# EAGLE design powermeter (EAGLE 9.6.2)

## Sheet 1 of 3
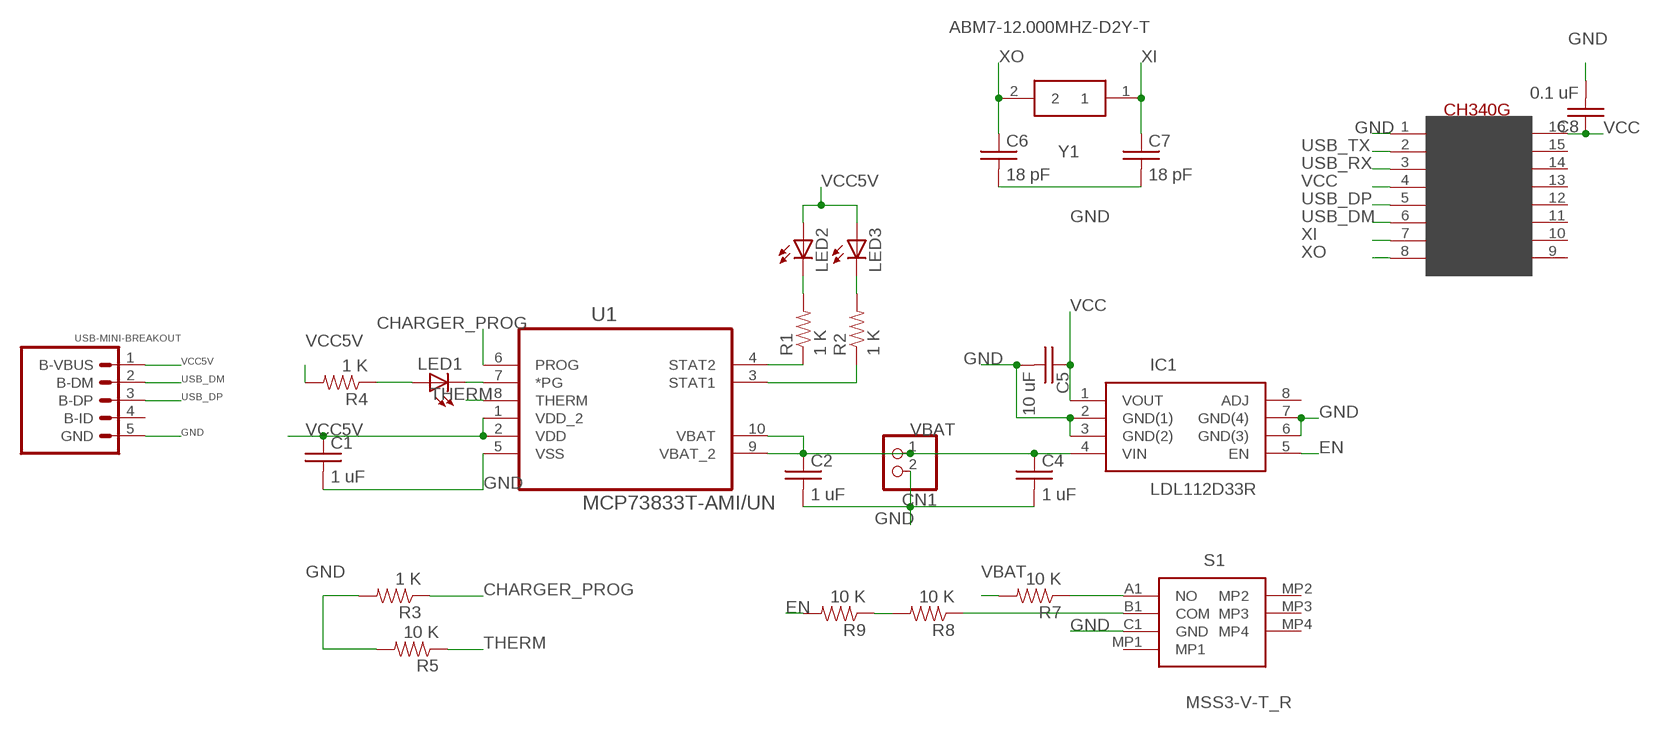
[diagram p0: schematic, sheet 1]

### Parts
C1  1 uF  C-USC0805K  [C0805K]
C2  1 uF  C-USC0805K  [C0805K]
C4  1 uF  C-USC0805K  [C0805K]
C5  10 uF  C-USC0805K  [C0805K]
C6  18 pF  C-USC0805K  [C0805K]
C7  18 pF  C-USC0805K  [C0805K]
C8  0.1 uF  C-USC0805K  [C0805K]
CN1  JST_2PIN-THM-RA  [JST-PH-2-THM-RA]
IC1  LDL112D33R  [SOIC127P600X175-8N]
LED1  LEDXZCFBB53W-8VF-2MA-LED  [LEDC1606X95N]
LED2  LEDXZCFBB53W-8VF-2MA-LED  [LEDC1606X95N]
LED3  LEDXZCFBB53W-8VF-2MA-LED  [LEDC1606X95N]
R1  1 K  RESISTORR0805-RES  [R0805]
R2  1 K  RESISTORR0805-RES  [R0805]
R3  1 K  RESISTORR0805-RES  [R0805]
R4  1 K  RESISTORR0805-RES  [R0805]
R5  10 K  RESISTORR0805-RES  [R0805]
R7  10 K  RESISTORR0805-RES  [R0805]
R8  10 K  RESISTORR0805-RES  [R0805]
R9  10 K  RESISTORR0805-RES  [R0805]
S1  MSS3-V-T_R  [MSS3VTR]
U1  MCP73833T-AMI/UN  [SOP50P490X110-10N]
U$4  CH340G  [SOIC16]
USB-MINI-BREAKOUT  USB-MINI-BREAKOUT  [1X05_LONGPADS]
Y1  ABM7-12.000MHZ-D2Y-T  [ABM7]

### Nets
CHARGER_PROG: R3.1 U1.6(PROG)
EN: IC1.5(EN) R9.2
GND: C1.2 C2.2 C4.2 C5.2 C6.2 C7.2 C8.2 CN1.2 IC1.2(GND(1)) IC1.3(GND(2)) IC1.6(GND(3)) IC1.7(GND(4)) R3.2 R5.2 S1.C1(GND) U1.5(VSS) U$4.1(GND) USB-MINI-BREAKOUT.5(GND) ; also sheet 2,3
N$1: R1.1 U1.4(STAT2)
N$2: LED1.2(C) U1.7(*PG)
N$3: LED1.1(A) R4.1
N$4: LED3.2(C) R2.2
N$5: R2.1 U1.3(STAT1)
N$6: LED2.2(C) R1.2
N$7: R8.2 R9.1
N$13: R8.1 S1.B1(COM)
N$15: R7.1 S1.A1(NO)
THERM: R5.1 U1.8(THERM)
USB_DM: U$4.6(D-) USB-MINI-BREAKOUT.2(B-DM)
USB_DP: U$4.5(D+) USB-MINI-BREAKOUT.3(B-DP)
USB_RX: U$4.3(RX) ; also sheet 3
USB_TX: U$4.2(TX) ; also sheet 3
VBAT: C2.1 C4.1 CN1.1 IC1.4(VIN) R7.2 U1.9(VBAT_2) U1.10(VBAT)
VCC: C5.1 C8.1 IC1.1(VOUT) U$4.4(V3) U$4.16(VCC) ; also sheet 2,3
VCC5V: C1.1 LED2.1(A) LED3.1(A) R4.2 U1.1(VDD_2) U1.2(VDD) USB-MINI-BREAKOUT.1(B-VBUS) ; also sheet 3
XI: C7.1 U$4.7(XI) Y1.1
XO: C6.1 U$4.8(XO) Y1.2
Unconnected: IC1.8(ADJ) S1.MP1 S1.MP2 S1.MP3 S1.MP4 U$4.9(CTS) U$4.10(DSR) U$4.11(RI) U$4.12(DCD) U$4.13(DTR) U$4.14(RTS) U$4.15(RS232) USB-MINI-BREAKOUT.4(B-ID)

## Sheet 2 of 3
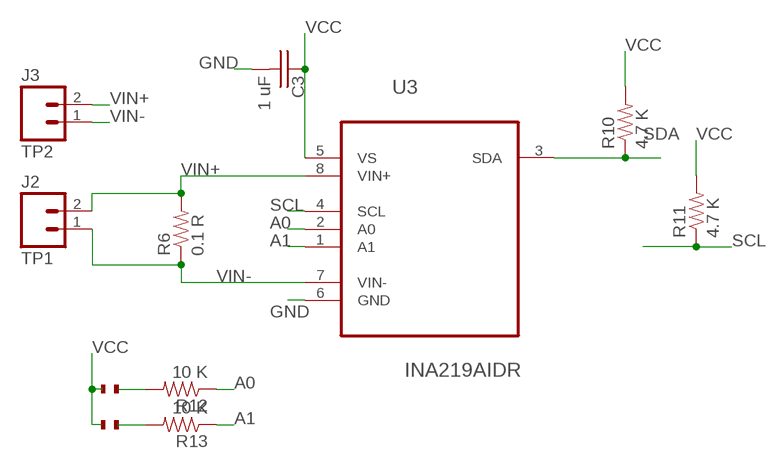
[diagram p1: schematic, sheet 2]

### Parts
C3  1 uF  C-USC0805K  [C0805K]
J2  TP1  M023.5MM  [SCREWTERMINAL-3.5MM-2]
J3  TP2  M02LOCK_LONGPADS  [1X02_LOCK_LONGPADS]
R6  0.1 R  RESISTOR2010  [R2010]
R10  4.7 K  RESISTORR0805-RES  [R0805]
R11  4.7 K  RESISTORR0805-RES  [R0805]
R12  10 K  RESISTORR0805-RES  [R0805]
R13  10 K  RESISTORR0805-RES  [R0805]
U3  INA219AIDR  [SOIC127P600X175-8N]
U$1  SURFACE_MOUNT_JUMP  [SURFACE_JUMPER]
U$2  SURFACE_MOUNT_JUMP  [SURFACE_JUMPER]

### Nets
A0: R12.1 U3.2(A0)
A1: R13.1 U3.1(A1)
GND: C3.2 U3.6(GND) ; also sheet 1,3
N$8: R12.2 U$1.2
N$10: R13.2 U$2.2
SCL: R11.1 U3.4(SCL) ; also sheet 3
SDA: R10.1 U3.3(SDA) ; also sheet 3
VCC: C3.1 R10.2 R11.2 U3.5(VS) U$1.1 U$2.1 ; also sheet 1,3
VIN+: J2.2 J3.2 R6.2 U3.8(VIN+)
VIN-: J2.1 J3.1 R6.1 U3.7(VIN-)

## Sheet 3 of 3
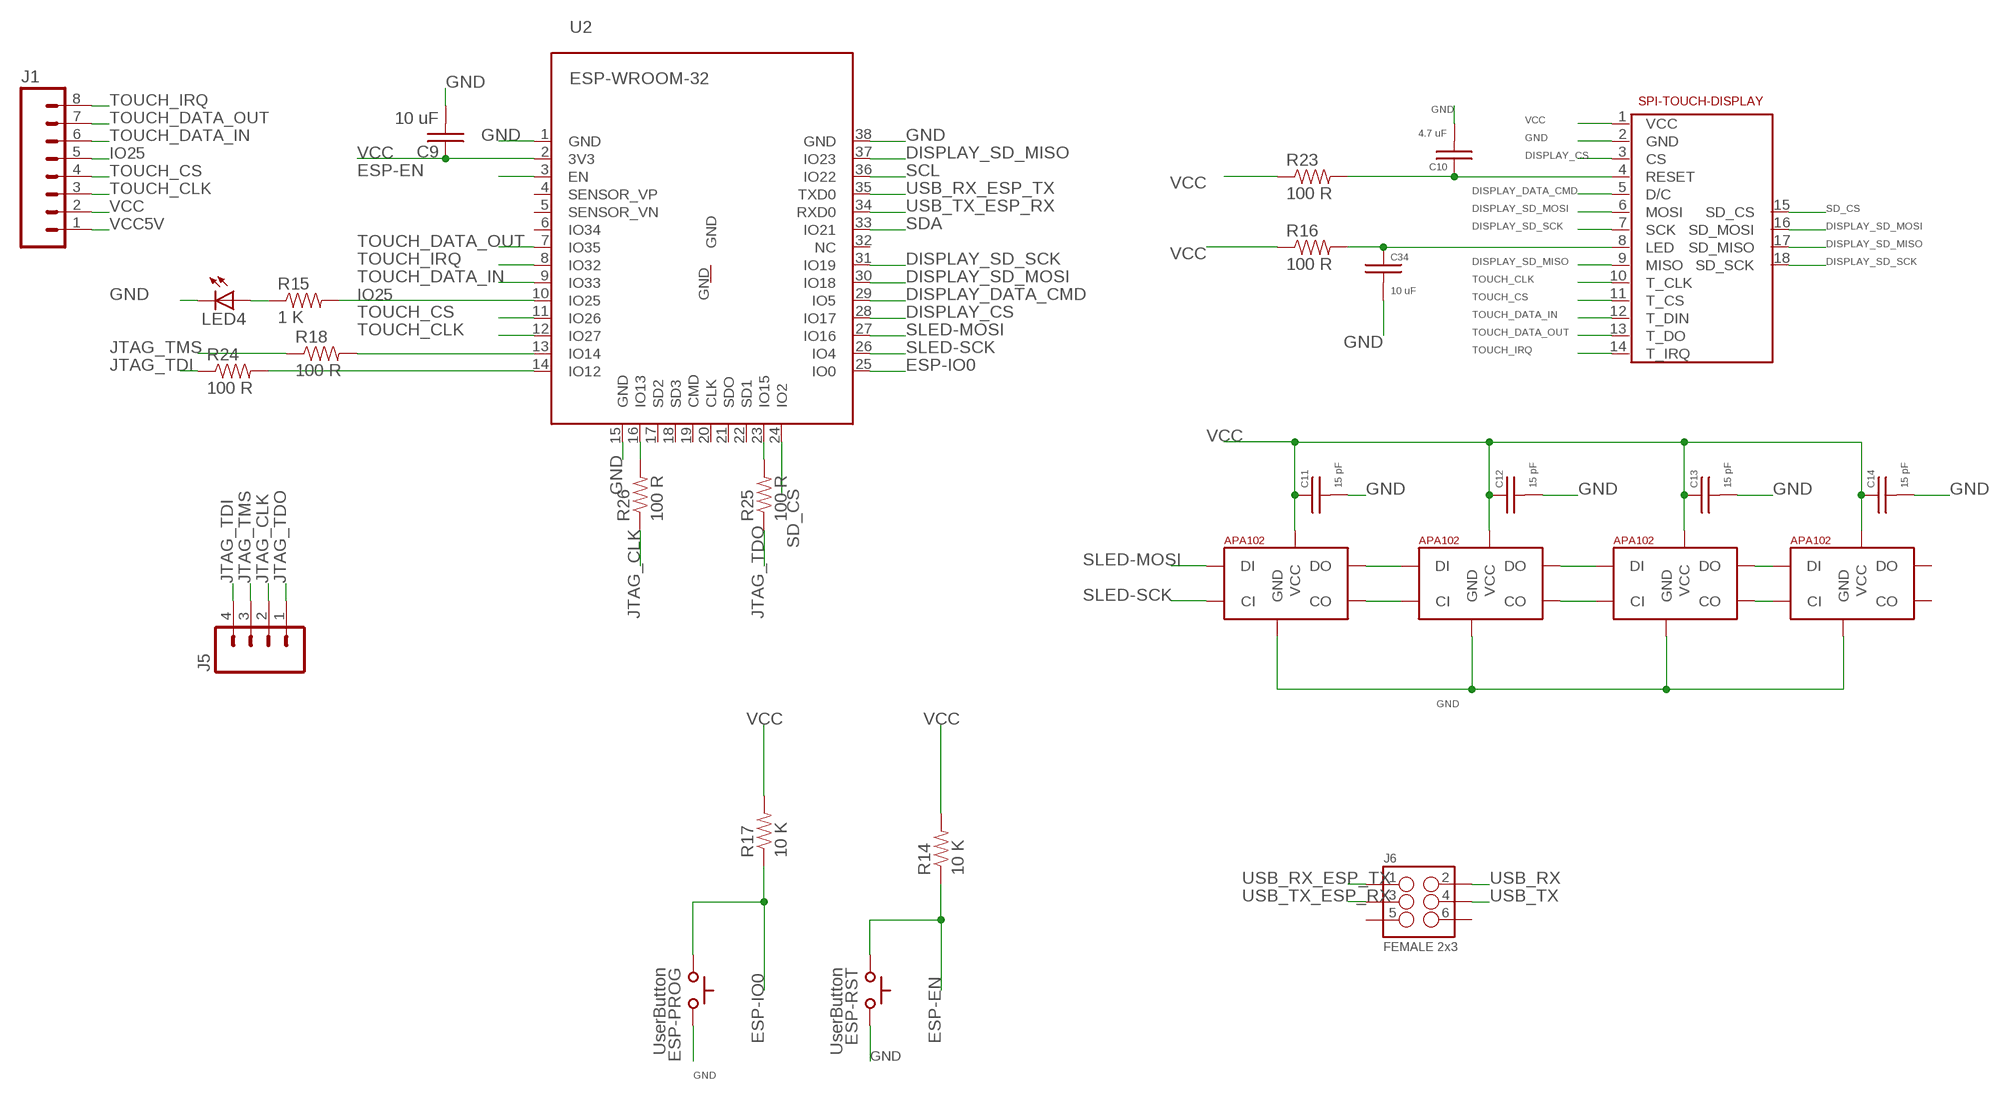
[diagram p2: schematic, sheet 3]

### Parts
C9  10 uF  C-USC0805K  [C0805K]
C10  4.7 uF  C-USC0805  [C0805]
C11  15 pF  C-USC0805  [C0805]
C12  15 pF  C-USC0805  [C0805]
C13  15 pF  C-USC0805  [C0805]
C14  15 pF  C-USC0805  [C0805]
C34  10 uF  C-USC0805  [C0805]
ESP-PROG  UserButton  SWITCH_TACTILETACTILE-2PIN-NARROW  [TACTILE-2PIN-NARROW]
ESP-RST  UserButton  SWITCH_TACTILETACTILE-2PIN-NARROW  [TACTILE-2PIN-NARROW]
J1  M08LONGPADS  [1X08_LONGPADS]
J5  M04LONGPADS  [1X04_LONGPADS]
J6  FEMALE 2x3  M03X2FEMALE  [2X3]
LED4  LED1206  [LED-1206]
R14  10 K  RESISTORR0805-RES  [R0805]
R15  1 K  RESISTORR0805-RES  [R0805]
R16  100 R  RESISTORR0805-RES  [R0805]
R17  10 K  RESISTORR0805-RES  [R0805]
R18  100 R  RESISTORR0805-RES  [R0805]
R23  100 R  RESISTORR0805-RES  [R0805]
R24  100 R  RESISTORR0805-RES  [R0805]
R25  100 R  RESISTORR0805-RES  [R0805]
R26  100 R  RESISTORR0805-RES  [R0805]
U2  ESP-WROOM-32  [ESP-WROOM-32]
U$3  2.4-SPI-TFT-TOUCH-SSD-MODULE  [2.4-SPI-TFT-TOUCH-SSD-MODULE]
U$5  APA1025050  [APA102_5050]
U$6  APA1025050  [APA102_5050]
U$7  APA1025050  [APA102_5050]
U$8  APA1025050  [APA102_5050]

### Nets
DISPLAY_BACKLIT: C34.1 R16.2 U$3.8(LED)
DISPLAY_CS: U2.28(IO17) U$3.3(CS)
DISPLAY_DATA_CMD: U2.29(IO5) U$3.5(D/C)
DISPLAY_RESET: C10.1 R23.2 U$3.4(RESET)
DISPLAY_SD_MISO: U2.37(IO23) U$3.9(MISO) U$3.17(SD_MISO)
DISPLAY_SD_MOSI: U2.30(IO18) U$3.6(MOSI) U$3.16(SD_MOSI)
DISPLAY_SD_SCK: U2.31(IO19) U$3.7(SCK) U$3.18(SD_SCK)
ESP-EN: ESP-RST.P$2(C) R14.1 U2.3(EN)
ESP-IO0: ESP-PROG.P$2(C) R17.1 U2.25(IO0)
GND: C9.2 C10.2 C11.2 C12.2 C13.2 C14.2 C34.2 ESP-PROG.P$1(A) ESP-RST.P$1(A) LED4.C U2.1(GND) U2.15(GND) U2.38(GND) U$3.2(GND) U$5.6(GND) U$6.6(GND) U$7.6(GND) U$8.6(GND) ; also sheet 1,2
IO25: J1.5 R15.2 U2.10(IO25)
JTAG_CLK: J5.2 R26.1
JTAG_TDI: J5.4 R24.1
JTAG_TDO: J5.1 R25.1
JTAG_TMS: J5.3 R18.1
N$9: R24.2 U2.14(IO12)
N$14: R26.2 U2.16(IO13)
N$17: LED4.A R15.1
N$18: U$5.2(CO) U$6.5(CI)
N$19: R18.2 U2.13(IO14)
N$20: R25.2 U2.23(IO15)
N$21: U$5.3(DO) U$6.4(DI)
N$22: U$6.3(DO) U$7.4(DI)
N$23: U$6.2(CO) U$7.5(CI)
N$24: U$7.2(CO) U$8.5(CI)
N$25: U$7.3(DO) U$8.4(DI)
SCL: U2.36(IO22) ; also sheet 2
SD_CS: U2.24(IO2) U$3.15(SD_CS)
SDA: U2.33(IO21) ; also sheet 2
SLED-MOSI: U2.27(IO16) U$5.4(DI)
SLED-SCK: U2.26(IO4) U$5.5(CI)
TOUCH_CLK: J1.3 U2.12(IO27) U$3.10(T_CLK)
TOUCH_CS: J1.4 U2.11(IO26) U$3.11(T_CS)
TOUCH_DATA_IN: J1.6 U2.9(IO33) U$3.12(T_DIN)
TOUCH_DATA_OUT: J1.7 U2.7(IO35) U$3.13(T_DO)
TOUCH_IRQ: J1.8 U2.8(IO32) U$3.14(T_IRQ)
USB_RX: J6.2 ; also sheet 1
USB_RX_ESP_TX: J6.1 U2.35(TXD0)
USB_TX: J6.4 ; also sheet 1
USB_TX_ESP_RX: J6.3 U2.34(RXD0)
VCC: C9.1 C11.1 C12.1 C13.1 C14.1 J1.2 R14.2 R16.1 R17.2 R23.1 U2.2(3V3) U$3.1(VCC) U$5.1(VCC) U$6.1(VCC) U$7.1(VCC) U$8.1(VCC) ; also sheet 1,2
VCC5V: J1.1 ; also sheet 1
Unconnected: J6.5 J6.6 U2.4(SENSOR_VP) U2.5(SENSOR_VN) U2.6(IO34) U2.17(SD2) U2.18(SD3) U2.19(CMD) U2.20(CLK) U2.21(SDO) U2.22(SD1) U2.32(NC) U2.GND U$8.2(CO) U$8.3(DO)

## Library data of the parts
C1-C14 C34 = passives:C-US: CAPACITOR, American symbol
CN1 = connector:JST_2PIN: JST 2-Pin Connectors of various flavors SMT-RA (S2B-PH-SM4) 4UConnector #17311 SMT (B2B-PH-SM4) THM-RA (S2B-PH) THM (B2B-PH)
ESP-PROG ESP-RST = dc-26:SWITCH_TACTILE
IC1 = voltage-regulator:LDL112D33R: LDO Voltage Regulators 1.2 A low quiescent current LDO with reverse current protection Source: Datasheet <https://www.arrow.com/en/products/ldl112d33r/stmicroelectronics>; ARROW_PART_NUMBER: LDL112D33R; ARROW_PRICE/STOCK: https://www.arrow.com/en/products/ldl112d33r/stmicroelectronics; DESCRIPTION: LDO Voltage Regulators 1.2 A low quiescent current LDO with reverse current protection; HEIGHT: 1.75mm; MANUFACTURER_NAME: STMicroelectronics; MANUFACTURER_PART_NUMBER: LDL112D33R
J1 = connector:M08: Header 8 Standard 8-pin 0.1" header. Use with straight break away headers (SKU : PRT-00116), right angle break away headers (PRT-00553), swiss pins (PRT-00743), machine pins (PRT-00117), and female headers (PRT-00115).
J2 = connector:M02: Standard 2-pin 0.1" header. Use with - straight break away headers ( PRT-00116) - right angle break away headers (PRT-00553) - swiss pins (PRT-00743) - machine pins (PRT-00117) - female headers (PRT-00115) Molex polarized connector foot print use with: PRT-08233 with associated crimp pins and housings. 2.54_SCREWTERM for use with PRT-10571. 3.5mm Screw Terminal footprints for PRT-08084 5mm Screw Terminal footprints for use with PRT-08432; PROD_ID: CONN-08399
J3 = connector:M02: Standard 2-pin 0.1" header. Use with - straight break away headers ( PRT-00116) - right angle break away headers (PRT-00553) - swiss pins (PRT-00743) - machine pins (PRT-00117) - female headers (PRT-00115) Molex polarized connector foot print use with: PRT-08233 with associated crimp pins and housings. 2.54_SCREWTERM for use with PRT-10571. 3.5mm Screw Terminal footprints for PRT-08084 5mm Screw Terminal footprints for use with PRT-08432
J5 = connector:M04: Header 4 Standard 4-pin 0.1" header. Use with straight break away headers (SKU : PRT-00116), right angle break away headers (PRT-00553), swiss pins (PRT-00743), machine pins (PRT-00117), and female headers (PRT-00115). Molex polarized connector foot print use with SKU : PRT-08231 with associated crimp pins and housings. 1MM SMD Version SKU: PRT-10208; PROD_ID: CONN-09696
J6 = connector:M03X2: 2x3 .1" header. Shrouded, with keying- CONN-10681 SMT- CONN-11415 Pogo pins- HW-11044; PROD_ID: CONN-11566
LED1-LED4 = leds:LED: LEDs Standard schematic elements and footprints for 5mm, 3mm, 1206, and 0603 sized LEDs. 5mm - Spark Fun Electronics SKU : COM-00529 (and others)
R1-R18 R23-R26 = passives:RESISTOR: Resistor Basic schematic elements and footprints for 0603, 1206, and PTH resistors.
S1 = switches:MSS3-V-T_R: Slide Switches Slide Type 1P2T (1.4mm height) Source: Datasheet <http://www.dip.com.tw/en/en-product-information/en-switch005/item/download/2643_3624e6da26abd0f9c3465d69564276ea>; DESCRIPTION: Slide Switches Slide Type 1P2T (1.4mm height); HEIGHT: 1.4mm; MANUFACTURER_NAME: Diptronics; MANUFACTURER_PART_NUMBER: MSS3-V-T/R; MOUSER_PART_NUMBER: 113-MSS3-V-T/R; MOUSER_PRICE-STOCK: https://www.mouser.com/Search/Refine.aspx?Keyword=113-MSS3-V-T%2FR
U1 = charging-ic:MCP73833T-AMI/UN: LI-ION/LI-POLY CONTROLLERS; AVAILABILITY: Unavailable; DESCRIPTION: Charger IC Lithium Ion/Polymer 10-MSOP; MF: Microchip; MP: MCP73833T-AMI/UN; PACKAGE: MSOP-10 Microchip; PRICE: None
U2 = ICs:ESP-WROOM-32
U3 = ICs:INA219AIDR: CURRENT/POWER MONITOR; AVAILABILITY: Unavailable; DESCRIPTION: Current Monitor Regulator High-Side 10mA 8-SOIC; MF: Texas Instruments; MP: INA219AIDR; PACKAGE: SOIC-8 Texas Instruments; PRICE: None
U$1 U$2 = connector:SURFACE_MOUNT_JUMP
U$3 = displays:2.4-SPI-TFT-TOUCH-SSD-MODULE: 2.4" SPI TFT Module Driver: ILI9341 DOTS: 240x320 Touch: YES
U$4 = protocol-converters:CH340G
U$5-U$8 = leds:APA102: APA102C 5050 RGB LED -- Adafruit DotStar Single LED Pixel Product Page: https://www.adafruit.com/products/2343 Datasheet: https://cdn-shop.adafruit.com/product-files/2343/APA102C.pdf
USB-MINI-BREAKOUT = connector:USB-MINI-BREAKOUT: Header 5 Standard 5-pin 0.1" header. Use with straight break away headers (SKU : PRT-00116), right angle break away headers (PRT-00553), swiss pins (PRT-00743), machine pins (PRT-00117), and female headers (PRT-00115). Molex polarized connector foot print use with SKU : PRT-08230 with associated crimp pins and housings.
Y1 = crystals-timing:ABM7-12.000MHZ-D2Y-T: ABRACON - ABM7-12.000MHZ-D2Y-T - CRYSTAL, 12MHZ, 18PF, SMD Source: Datasheet <http://www.abracon.com/Resonators/abm7.pdf>; DESCRIPTION: ABRACON - ABM7-12.000MHZ-D2Y-T - CRYSTAL, 12MHZ, 18PF, SMD; HEIGHT: mm; MANUFACTURER_NAME: ABRACON; MANUFACTURER_PART_NUMBER: ABM7-12.000MHZ-D2Y-T; MOUSER_PART_NUMBER: 815-ABM7-12-D2Y-T; MOUSER_PRICE-STOCK: https://www.mouser.com/Search/Refine.aspx?Keyword=815-ABM7-12-D2Y-T; RS_PART_NUMBER: 1710625P; RS_PRICE-STOCK: http://uk.rs-online.com/web/p/products/1710625P

## Board
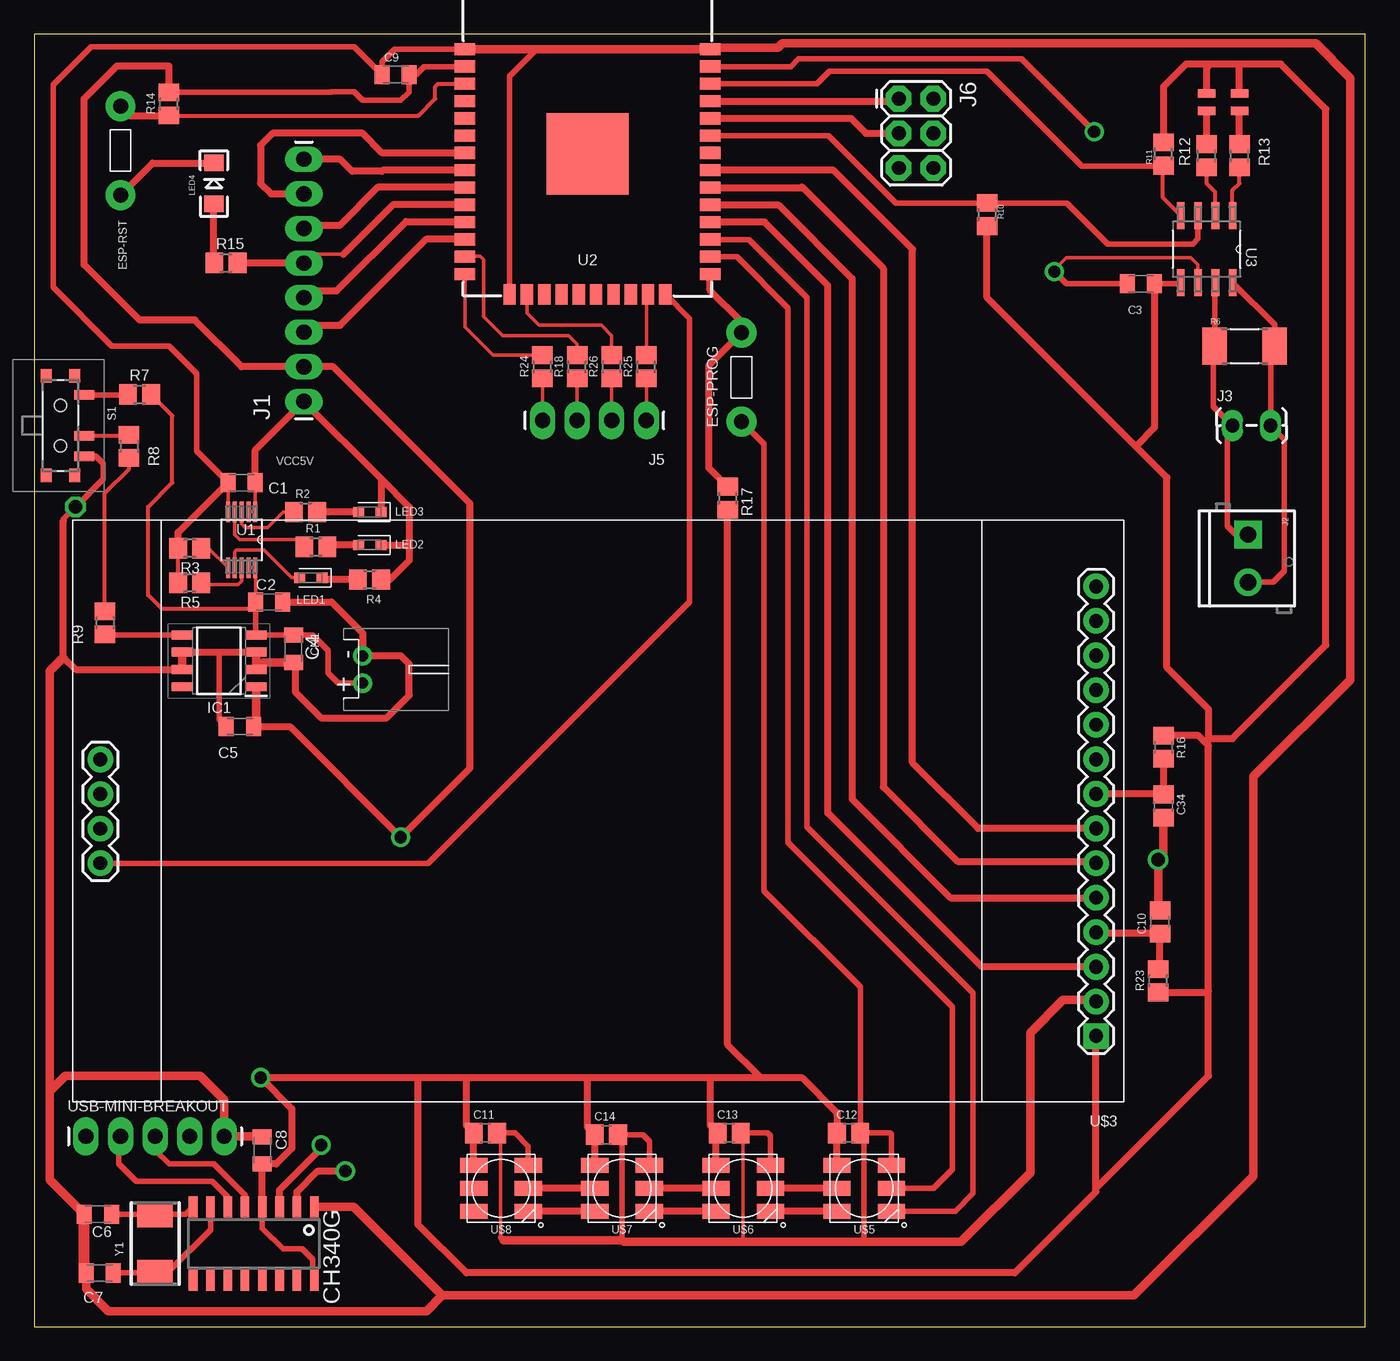
[diagram p3: board, top side]
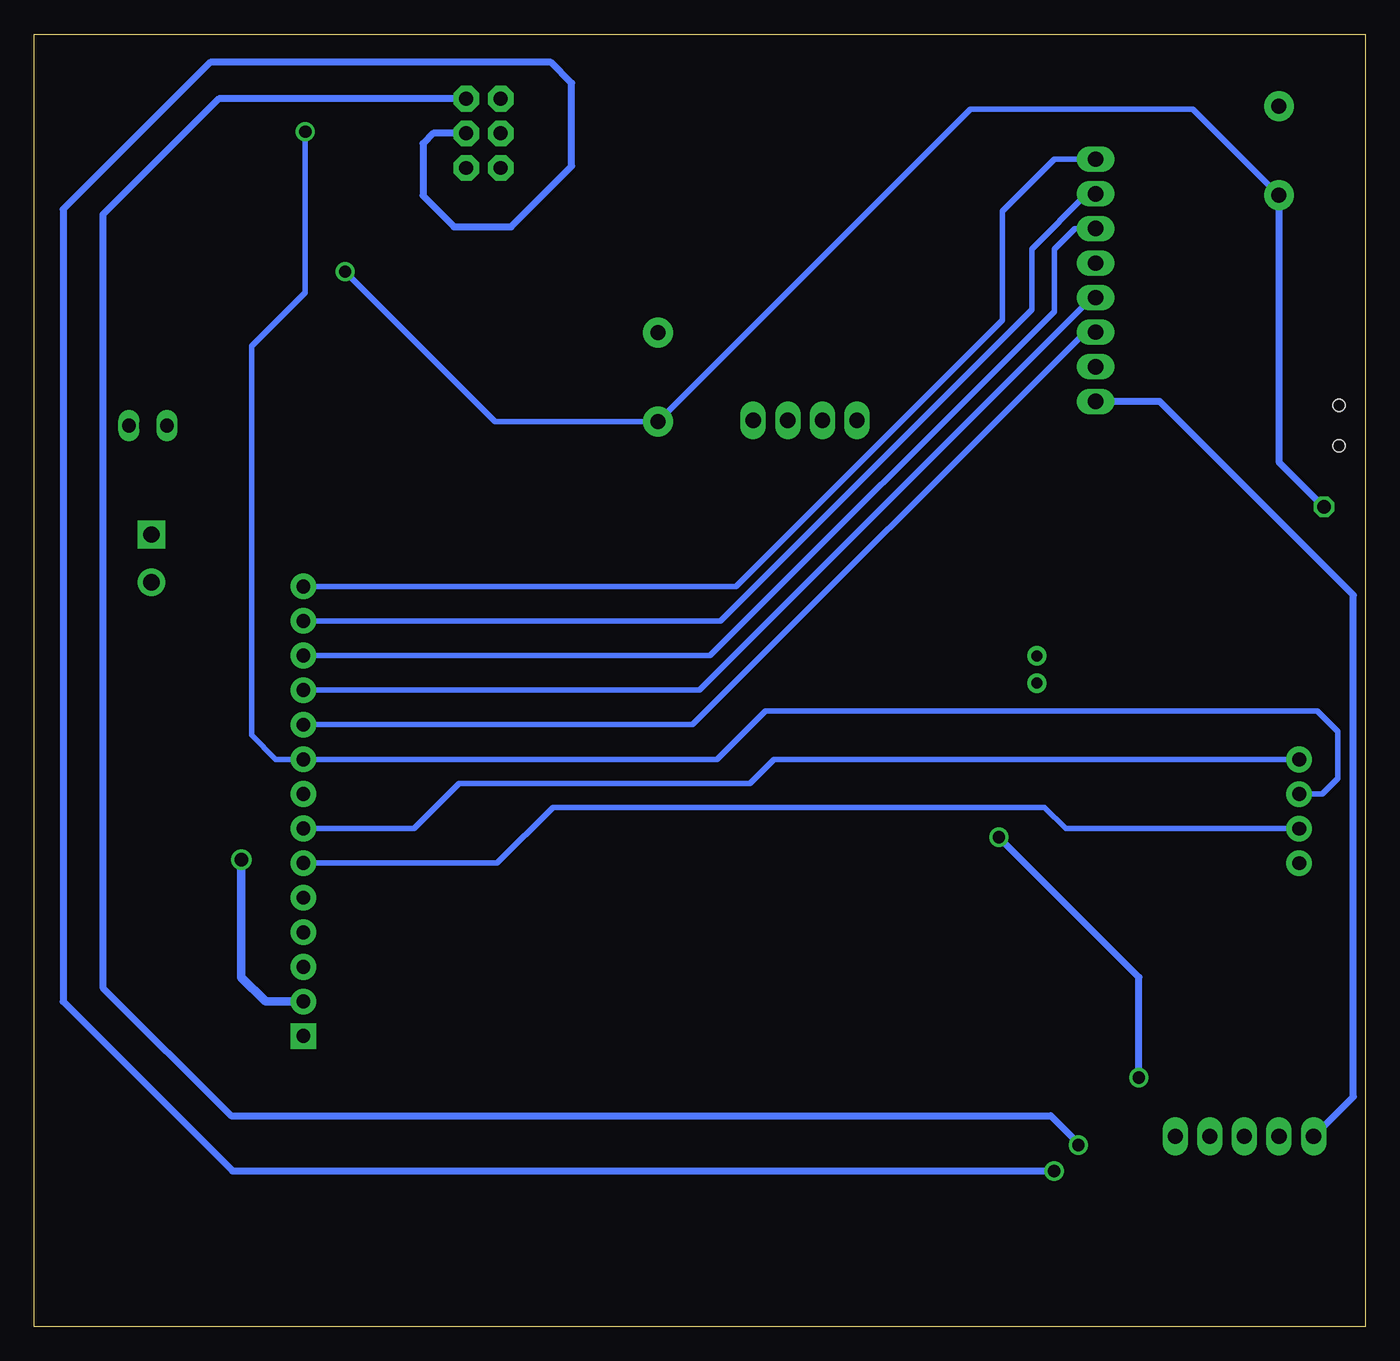
[diagram p4: board, bottom side, seen from below]

Size 97.77 x 94.92 mm. Coordinates in mm from the lower left corner, seen from the top.
Outline: 0,0 97.77,0 97.77,94.92 0,94.92 0,0
Copper layers (1*16): Top 0.035mm / dielectric 1.5mm / Bottom 0.035mm
Design rules "OthermillDRC_30_deg_v2": minimum track width 6mil, minimum drill 0.8mm, track to track 6mil, track to pad 6mil, pad to pad 6mil, via to via 6mil, smd to smd 0mil, copper to edge 0mil, drill to drill 6mil, minimum pad ring 10mil, minimum via ring 10mil, stop-mask expansion 1mil, vias tented up to drill 30mil, thermal gap 6mil

### Footprints (pad centres in the part's own frame; a part is rotated, then mirrored left to right if it is on the bottom)
C0805K = smd 1.1 x 1.4: 1 -1,0; 2 1,0
C0805 = smd 1.3 x 1.5: 1 -0.85,0; 2 0.85,0
JST-PH-2-THM-RA = drill 0.8 pad 1.422: 1 1,0; 2 -1,0
TACTILE-2PIN-NARROW = drill 1.1 pad 2.184: P$1 3.264,0; P$2 -3.264,0
SOIC127P600X175-8N = smd 1.525 x 0.65: 1 -2.712,1.905; 2 -2.712,0.635; 3 -2.712,-0.635; 4 -2.712,-1.905; 5 2.712,-1.905; 6 2.712,-0.635; 7 2.712,0.635; 8 2.712,1.905
1X08_LONGPADS = drill 1.118 pad 1.88 long: 1 0,0; 2 2.54,0; 3 5.08,0; 4 7.62,0; 5 10.16,0; 6 12.7,0; 7 15.24,0; 8 17.78,0
SCREWTERMINAL-3.5MM-2 = drill 1.2 pad 2.032 square: 1 0,0 | drill 1.2 pad 2.032: 2 3.5,0
1X02_LOCK_LONGPADS = drill 1.016 long: 1 -0.127,0; 2 2.667,0
1X04_LONGPADS = drill 1.118 pad 1.88 long: 1 0,0; 2 2.54,0; 3 5.08,0; 4 7.62,0
2X3 = drill 1.016 pad 1.88 octagon: 1 0,0; 2 0,2.54; 3 2.54,0; 4 2.54,2.54; 5 5.08,0; 6 5.08,2.54
LEDC1606X95N = smd 0.81 x 0.75: 1 -0.82,0; 2 0.82,0
LED-1206 = smd 1.2 x 1.4: A -1.5,0; C 1.5,0
R0805 = smd 1.3 x 1.5: 1 -0.85,0; 2 0.85,0
R2010 = smd 1.8 x 2.7: 1 -2.2,0; 2 2.2,0
MSS3VTR = smd 0.7 x 1.5: A1 -2.25,3.05; B1 0.75,3.05; C1 2.25,3.05 | smd 1 x 0.8: MP1 -3.65,2.35; MP2 -3.65,0.25; MP3 3.65,0.25; MP4 3.65,2.35 | hole 0.9: -1.5,1.3; 1.5,1.3
SOP50P490X110-10N = smd 1.499 x 0.305: 1 -2.057,0.991; 2 -2.057,0.508; 3 -2.057,0; 4 -2.057,-0.508; 5 -2.057,-0.991; 6 2.057,-0.991; 7 2.057,-0.508; 8 2.057,0; 9 2.057,0.508; 10 2.057,0.991
ESP-WROOM-32 = smd 0.9 x 1.5: 1 7.7,9; 2 6.43,9; 3 5.16,9; 4 3.89,9; 5 2.62,9; 6 1.35,9; 7 0.08,9; 8 -1.19,9; 9 -2.46,9; 10 -3.73,9; 11 -5,9; 12 -6.27,9; 13 -7.54,9; 14 -8.81,9; 25 -8.81,-9; 26 -7.54,-9; 27 -6.27,-9; 28 -5,-9; 29 -3.73,-9; 30 -2.46,-9; 31 -1.19,-9; 32 0.08,-9; 33 1.35,-9; 34 2.62,-9; 35 3.89,-9; 36 5.16,-9; 37 6.43,-9; 38 7.7,-9 | smd 1.5 x 0.9: 15 -10.3,5.715; 16 -10.3,4.445; 17 -10.3,3.175; 18 -10.3,1.905; 19 -10.3,0.635; 20 -10.3,-0.635; 21 -10.3,-1.905; 22 -10.3,-3.175; 23 -10.3,-4.445; 24 -10.3,-5.715 | smd 6 x 6: GND 0,0
SOIC127P600X175-8N' = smd 1.981 x 0.559: 1 -2.464,1.905; 2 -2.464,0.635; 3 -2.464,-0.635; 4 -2.464,-1.905; 5 2.464,-1.905; 6 2.464,-0.635; 7 2.464,0.635; 8 2.464,1.905
SURFACE_JUMPER = smd 1.27 x 0.635: 1 0,0.635; 2 0,-0.635
2.4-SPI-TFT-TOUCH-SSD-MODULE = drill 1.016 pad 1.88 square: 1 4.83,2.02 | drill 1.016 pad 1.88: 2 7.37,2.02; 3 9.91,2.02; 4 12.45,2.02; 5 14.99,2.02; 6 17.53,2.02; 7 20.07,2.02; 8 22.61,2.02; 9 25.15,2.02; 10 27.69,2.02; 11 30.23,2.02; 12 32.77,2.02; 13 35.31,2.02; 14 37.85,2.02; 15 17.52,75.14; 16 20.06,75.14; 17 22.6,75.14; 18 25.14,75.14
SOIC16 = smd 0.635 x 1.524: 1 -4.445,-2.695; 2 -3.175,-2.695; 3 -1.905,-2.695; 4 -0.635,-2.695; 5 0.635,-2.695; 6 1.905,-2.695; 7 3.175,-2.695; 8 4.445,-2.695; 9 4.445,2.695; 10 3.175,2.695; 11 1.905,2.695; 12 0.635,2.695; 13 -0.635,2.695; 14 -1.905,2.695; 15 -3.175,2.695; 16 -4.445,2.695
APA102_5050 = smd 2 x 1.1: 1 2,-1.7; 2 2,0; 3 2,1.7; 4 -2,1.7; 5 -2,0; 6 -2,-1.7
1X05_LONGPADS = drill 1.118 pad 1.88 long: 1 0,0; 2 2.54,0; 3 5.08,0; 4 7.62,0; 5 10.16,0
ABM7 = smd 1.9 x 2.6: 1 -2.15,0; 2 2.15,0

### Placement (x,y rotation side)
C1  15.24,61.98 180 top
C2  17.27,53.21 0 top
C3  81.28,76.58 180 top
C4  19.05,49.78 270 top
C5  15.11,44.07 180 top
C6  4.7,8.26 180 top
C7  4.83,3.94 180 top
C8  16.76,12.95 90 top
C9  26.54,91.95 180 top
C10  82.68,29.72 90 top
C11  33.15,14.22 0 top
C12  59.82,14.22 0 top
C13  51.05,14.22 0 top
C14  42.04,14.1 0 top
C34  82.93,38.23 270 top
CN1  24.13,48.26 270 top
ESP-PROG  51.94,69.72 270 top
ESP-RST  6.35,86.36 270 top
IC1  13.59,48.9 180 top
J1  19.81,67.94 90 top
J2  89.15,58.17 270 top
J3  88.14,66.17 0 top
J5  44.96,66.55 180 top
J6  63.5,90.17 270 top
LED1  20.32,54.99 180 top
LED2  24.65,57.4 180 top
LED3  24.65,59.82 180 top
LED4  13.21,83.95 90 top
R1  20.7,57.28 0 top
R2  19.94,59.82 0 top
R3  11.43,57.15 180 top
R4  24.64,54.86 0 top
R5  11.43,54.61 180 top
R6  88.9,72.01 0 top
R7  7.75,68.45 0 top
R8  6.99,64.64 270 top
R9  5.21,51.69 270 top
R10  69.98,81.66 270 top
R11  82.93,86.11 90 top
R12  86.11,85.98 90 top
R13  88.52,85.98 90 top
R14  9.91,89.79 90 top
R15  14.1,78.11 0 top
R16  82.93,42.55 270 top
R17  50.93,60.83 270 top
R18  39.88,70.48 90 top
R23  82.55,25.4 90 top
R24  37.34,70.48 90 top
R25  44.96,70.48 90 top
R26  42.42,70.48 90 top
S1  0.64,66.17 270 top
U1  15.24,57.78 270 top
U2  40.64,86.11 90 top
U3  INA219AIDR  [SOIC127P600X175-8N']  86.11,79.12 270 top
U$1  86.11,89.92 0 top
U$2  88.52,89.92 0 top
U$3  80.01,16.51 90 top
U$4  16.13,6.1 180 top
U$5  60.96,10.16 180 top
U$6  52.07,10.16 180 top
U$7  43.18,10.16 180 top
U$8  34.29,10.16 180 top
USB-MINI-BREAKOUT  3.81,13.97 0 top
Y1  8.89,6.1 90 top

### Tracks (layer width: path | path; a pad name or v marks a point on that pad's centre or on a via)
A0
  Top 0.305: U3.2 86.74,83.31 86.11,83.95 R12.1
A1
  Top 0.305: U3.1 88.01,83.44 88.52,83.95 R13.1
CHARGER_PROG
  Top 0.254: U1.6 12.83,57.15 R3.1
DISPLAY_BACKLIT
  Top 0.508: R16.2 C34.1 82.89,39.12 U$3.8
DISPLAY_CS
  Top 0.508: U$3.3 69.59,26.42 58.29,37.72 58.29,76.45 53.64,81.11 U2.28
DISPLAY_DATA_CMD
  Top 0.508: U2.29 54.66,82.38 60.07,76.96 60.07,38.73 67.31,31.5 U$3.5
DISPLAY_RESET
  Top 0.508: R23.2 82.68,26.38 C10.1 78.08,28.87 U$3.4
DISPLAY_SD_MISO  (via drill 0.9)
  Top 0.406: U2.37 55.58,92.54 56.13,93.09 72.52,93.09 v77.85,87.76
  Bottom 0.406: v77.85,87.76 77.85,75.95 81.79,72.01 81.79,43.43 80.01,41.66 U$3.9 47.62,41.66 44.07,45.21 3.56,45.21 2.03,43.69 2.03,40.26 3.18,39.11 U$3.17
DISPLAY_SD_MOSI
  Top 0.508: U2.30 56.34,83.65 56.39,83.69 62.36,77.72 62.36,39.62 67.82,34.16 77.87,34.16 U$3.6
  Bottom 0.406: U$3.16 21.99,36.57 23.56,38.14 59.65,38.14 63.75,34.04 U$3.6
DISPLAY_SD_SCK
  Top 0.508: U2.31 58.72,84.92 64.52,79.12 64.52,41.4 69.34,36.58 U$3.7
  Bottom 0.305: U$3.7
  Bottom 0.406: U$3.18 43.44,41.65 45.21,39.88 66.55,39.88 69.85,36.58 U$3.7
EN
  Top 0.406: IC1.5 5.25,50.8 R9.2
ESP-EN
  Top 0.305: R14.1 28.23,88.94 29.46,90.17 29.46,91.06 29.67,91.27 U2.3
  Top 0.508: R14.1 9.87,88.9 7.07,88.9 ESP-RST.P$2
ESP-IO0
  Top 0.508: R17.1 49.53,63.08 49.53,70.57 ESP-PROG.P$2 51.94,73.79 49.64,76.09 U2.25
GND  (via drill 0.9, 1)
  Top 0.254: U1.5 14.24,59.85 C1.2 | C11.2 34.25,13.97 34.25,6.57 | C13.2 52.07,14.06 52.07,6.22 | U3.6 85.47,77.98 84.96,78.49 75.82,78.49 74.93,77.6 v74.93,77.47
  Top 0.305: R5.2 R3.2
  Top 0.406: U2.15 34.92,91.82 36.91,93.81 | U2.1 26.46,93.81 25.54,92.89 C9.2 23.51,93.98 4.19,93.98 1.4,91.19 1.4,76.33 5.71,72.01 9.91,72.01 11.94,69.98 11.94,64.28 C1.2 | U2.38 49.77,93.93 | C11.2 35.31,14.22 36.29,13.24 U$8.6 | C13.2 53.85,14.22 54.07,14 U$6.6 | C12.2 62.87,14.22 62.96,14.13 U$5.6 | 77.87,24 U$3.2 | 82.93,34.67 v82.55,34.29 | C3.2 75.82,76.58 v74.93,77.47 | C5.2 13.59,44.59 13.59,49.53 | C6.2 3.68,8.26 | U$7.6 45.18,13.62 44.7,14.1 C14.2 43.18,13.8 43.18,6.35 43.31,6.22 | 34.25,6.57 34.47,6.35 | C12.2 60.96,13.93 60.96,6.22 | C12.2 60.67,24.93 53.59,32 53.59,64.81 ESP-PROG.P$1 | 2.16,59.18 2.16,59.31 v3.05,60.2 5.08,62.23 5.08,63.37 4.54,63.92 S1.C1
  Top 0.508: R3.2 10.58,58.32 C1.2 | 2.16,59.18 2.16,49.15 3.05,48.26 IC1.7 | IC1.6 13.59,49.53 IC1.3 | C4.2 19.18,48.66 19.18,46.61 21.08,44.7 25.91,44.7 27.56,46.35 27.56,48.64 26.94,49.26 CN1.2 24.13,50.93 21.84,53.21 C2.2 | C7.2 3.7,4.06 | C8.2 16.75,13.97 | ESP-RST.P$1 8.7,85.45 LED4.C
  Top 0.61: IC1.6 IC1.7 | IC1.3 IC1.2 16.82,48.78 C4.2 | U2.38 36.91,93.81 U2.1 | 49.77,93.93 54.64,93.93 54.94,94.23 94.11,94.23 96.65,91.69 96.65,47.5 89.53,40.39 89.53,11.05 80.77,2.29 29.97,2.29 | 16.75,13.97 USB-MINI-BREAKOUT.5 13.97,16.64 12.19,18.41 2.29,18.41 1.14,17.27 | 29.97,2.29 23.47,8.79 U$4.1 | 77.87,24 75.56,24 73.15,21.59 73.15,11.3 68.07,6.22 60.96,6.22 52.07,6.22 43.31,6.22 | C10.2 82.55,30.7 v82.55,34.29 | C34.2 82.93,34.67 | 1.14,17.27 1.14,10.79 3.68,8.26 | C7.2 3.83,2.78 5.46,1.14 28.83,1.14 29.97,2.29 | 34.47,6.35 43.18,6.35 | 1.14,17.27 1.14,48.13 2.16,49.15
  Top 0.813: 3.7,4.06 C6.2
  Bottom 0.406: ESP-RST.P$1 12.66,89.41 28.99,89.41 ESP-PROG.P$1 63.92,66.46 v74.93,77.47
  Bottom 0.508: v3.05,60.2 6.35,63.5 ESP-RST.P$1
  Bottom 0.61: U$3.2 80.78,23.88 82.55,25.65 v82.55,34.29
IO25
  Top 0.254: 31.59,82.42 U2.10 | 20.45,78.74 22.73,78.74
  Top 0.508: 20.45,78.74 J1.5 R15.2 | 22.73,78.74 26.42,82.42 31.59,82.42
JTAG_CLK
  Top 0.254: J5.2 R26.1
JTAG_TDI
  Top 0.254: J5.4 R24.1
JTAG_TDO
  Top 0.254: J5.1 R25.1
JTAG_TMS
  Top 0.254: J5.3 R18.1
N$1
  Top 0.254: U1.4 14.73,58.17 15.11,57.78 19.34,57.78 R1.1
N$2
  Top 0.254: U1.7 14.73,56.9 14.86,57.02 16.89,57.02 18.92,54.99 LED1.2
N$3
  Top 0.508: R4.1 21.27,54.86 LED1.1
N$4
  Top 0.508: LED3.2 R2.2
N$5
  Top 0.254: U1.3 15.24,58.93 15.49,58.67 17.14,58.67 18.29,59.82 R2.1
N$6
  Top 0.508: LED2.2 21.68,57.4 R1.2
N$7
  Top 0.305: R9.1 5.21,61.21 6.99,62.99 R8.2
N$8
  Top 0.508: R12.2 U$1.2
N$9
  Top 0.254: U2.14 31.64,73.39 33.69,71.33 R24.2
N$10
  Top 0.508: R13.2 U$2.2
N$13
  Top 0.305: S1.B1 6.91,65.42 R8.1
N$14
  Top 0.254: U2.16 36.2,74.42 37.08,73.53 41.66,73.53 42.42,72.77 R26.2
N$15
  Top 0.406: S1.A1 6.86,68.42 R7.1
N$17
  Top 0.254: R15.1 13.21,78.14
  Top 0.508: 13.21,78.14 LED4.A
N$18
  Top 0.508: U$5.2 U$6.5
N$19
  Top 0.254: U2.13 31.69,78.61 32.77,78.61 33.02,78.36 33.02,74.17 34.42,72.77 39.24,72.77 39.88,72.14 R18.2
N$20
  Top 0.254: R25.2 44.96,75.68 U2.23
N$21
  Top 0.508: U$5.3 U$6.4
N$22
  Top 0.508: U$6.3 U$7.4
N$23
  Top 0.508: U$6.2 U$7.5
N$24
  Top 0.508: U$7.2 U$8.5
N$25
  Top 0.508: U$7.3 U$8.4
SCL
  Top 0.305: U3.4 82.89,82.89 82.89,85.22
  Top 0.406: U2.36 57.48,91.27 58.42,92.2 69.98,92.2 76.96,85.22 82.89,85.22 R11.1
SD_CS
  Top 0.406: U2.24 48.13,74.03 48.13,53.21 28.95,34.03 U$3.15
SDA
  Top 0.406: U3.3 85.47,79.88 85.09,79.5 78.87,79.5 75.86,82.51 R10.1 63.28,82.51 58.34,87.46 U2.33
SLED-MOSI
  Top 0.406: U2.27 52.5,79.84 56.77,75.56 56.77,36.7 68.96,24.51 68.96,9.78 67.64,8.46 U$5.4
SLED-SCK
  Top 0.406: U2.26 51.61,78.57 55.37,74.8 55.37,35.56 67.44,23.5 67.44,11.56 66.04,10.16 U$5.5
THERM
  Top 0.254: U1.8 15.24,54.74 14.99,54.48 12.41,54.48 R5.1
TOUCH_CLK
  Top 0.254: 31.59,79.88 U2.12
  Top 0.508: J1.3 20.32,73.53 22.48,73.53 28.83,79.88 31.59,79.88
  Bottom 0.254: 20.57,73.03 J1.3
  Bottom 0.406: U$3.10 49.4,44.2 20.57,73.03
TOUCH_CS
  Top 0.254: 31.59,81.15 U2.11
  Top 0.508: J1.4 20.32,76.07 22.23,76.07 27.3,81.15 31.59,81.15
  Bottom 0.254: 20.45,75.18 20.19,75.18 J1.4
  Bottom 0.406: U$3.11 48.89,46.74 20.45,75.18
TOUCH_DATA_IN
  Top 0.254: 31.59,83.69 U2.9
  Top 0.508: J1.6 20.07,80.9 22.48,80.9 25.27,83.69 31.59,83.69
  Bottom 0.406: J1.6 21.34,80.64 22.86,79.12 22.86,74.55 48.13,49.28 U$3.12
TOUCH_DATA_OUT
  Top 0.508: U2.7 25.57,86.19 24.13,87.63 17.53,87.63 16.64,86.74 16.64,83.95 17.4,83.19 J1.7
  Bottom 0.406: J1.7 20.45,83.19 24.51,79.12 24.51,74.68 47.37,51.82 U$3.13
TOUCH_IRQ
  Top 0.254: 25.61,84.92 25.53,84.84
  Top 0.508: U2.8 25.61,84.92 | 25.53,84.84 23.37,84.84 22.48,85.72 J1.8
  Bottom 0.406: J1.8 22.86,85.72 26.67,81.92 26.67,73.92 46.23,54.36 U$3.14
USB_DM
  Top 0.406: U$4.6 14.22,9.53 13.08,10.67 7.49,10.67 6.22,11.94 6.22,13.84 USB-MINI-BREAKOUT.2
USB_DP
  Top 0.406: U$4.5 15.49,9.65 13.21,11.94 9.91,11.94 8.89,12.95 USB-MINI-BREAKOUT.3
USB_RX  (via drill 0.9)
  Top 0.508: U$4.3 18.03,10.03 21.08,13.08 v21.08,13.34
  Bottom 0.508: v21.08,13.34 21.08,13.46 23.11,15.49 83.31,15.49 92.71,24.89 92.71,81.66 84.2,90.17 J6.2
USB_RX_ESP_TX
  Top 0.508: U2.35 63.33,90 J6.1
USB_TX  (via drill 0.9)
  Top 0.508: U$4.2 19.3,9.91 20.83,11.43 v22.86,11.43
  Bottom 0.508: J6.4 68.45,87.63 69.22,86.87 69.22,83.06 66.93,80.77 62.74,80.77 58.29,85.22 58.29,91.31 59.82,92.84 84.84,92.84 95.63,82.04 95.63,23.88 83.19,11.43 v22.86,11.43
USB_TX_ESP_RX
  Top 0.508: U2.34 59.99,88.73 61.09,87.63 J6.3
VBAT
  Top 0.254: U1.9 U1.10 16.27,55.69 C2.1
  Top 0.305: C2.1 15.76,52.7 9.4,52.7 8.38,53.72 8.38,60.2 10.16,61.98 10.16,66.89 R7.2
  Top 0.406: C2.1 16.27,50.83 IC1.4 19.03,50.8 C4.1 20.46,50.78 21.59,49.66 21.59,48.01 22.34,47.26 CN1.1
VCC  (via drill 0.9)
  Top 0.406: U$4.4 16.76,7.24 18.29,5.71 19.68,5.71 20.45,4.95 20.45,3.53 U$4.16 | R14.2 21.8,90.64 21.84,90.68 23.5,90.68 24.13,90.04 26.92,90.04 27.54,90.66 C9.1 28.07,91.95 28.66,92.54 U2.2 | 86.23,42.67 86.23,43.18 | C3.1 84.12,76.58 U3.5
  Top 0.508: 16.3,44.26 C5.1 18.8,44.07 v26.92,35.94 32,41.02 32,60.45 21.97,70.48 J1.2 15.24,70.48 11.81,73.91 7.75,73.91 3.68,77.98 3.68,90.17 6.1,92.58 9.91,92.58 R14.2 | U$4.4 C8.1 17.8,11.95 18.92,13.08 18.92,16 v16.64,18.29 28.19,18.29 | 28.19,18.29 31.75,18.29 | 31.75,18.29 40.64,18.29 | 40.64,18.29 49.66,18.29 | 49.66,18.29 53.34,18.29 | 53.34,18.29 56.39,18.29 58.97,15.71 C12.1 U$5.1 | 49.66,18.29 49.66,14.77 C13.1 50.07,14.09 U$6.1 | 40.64,18.29 40.64,14.64 C14.1 U$7.1 | 31.75,18.29 31.75,14.77 C11.1 U$8.1 | 77.99,10.16 77.99,9.92 72.01,3.94 31.75,3.94 28.19,7.49 28.19,18.29 | 77.99,10.16 U$3.1 | 77.99,10.16 86.23,18.4 86.23,24.64 | 86.23,24.64 86.23,42.67 85.51,43.4 R16.1 | R23.1 86.14,24.55 86.23,24.64 | 53.34,18.29 50.93,20.7 R17.2 | R10.2 69.98,75.56 80.9,64.64 | 80.9,64.64 83.19,62.36 83.19,48.39 86.23,45.34 86.23,43.18 88.01,43.18 94.87,50.04 94.87,89.41 91.57,92.71 88.52,92.71 | C3.1 82.28,66.02 80.9,64.64 | 88.52,92.71 86.36,92.71 | 86.36,92.71 84.58,92.71 82.93,91.06 R11.2 | U$1.1 86.11,92.46 86.36,92.71 | U$2.1 88.52,92.71
  Top 0.61: IC1.1 16.3,44.26
  Bottom 0.508: v16.64,18.29 16.64,25.65 v26.92,35.94
VCC5V
  Top 0.254: U1.2 U1.1 16.24,59.85 C1.1
  Top 0.508: C1.1 16.24,64.37 J1.1 25.47,62.29 | 25.47,62.29 LED3.1 | 25.47,62.29 27.56,60.2 27.56,57.4 | 27.56,57.4 27.56,56.26 26.16,54.86 R4.2 | LED2.1 27.56,57.4
  Bottom 0.508: USB-MINI-BREAKOUT.1 0.89,16.89 0.89,53.72 15.11,67.94 J1.1
VIN+
  Top 0.406: U3.8 91.1,73.57 R6.2 90.81,71.71 J3.2 91.82,65.15 91.82,55.5 90.99,54.67 J2.2
VIN-
  Top 0.406: U3.7 86.7,76.62 R6.1 86.61,71.92 86.61,67.56 J3.1 87.63,65.79 87.63,58.8 88.27,58.17 J2.1
XI
  Top 0.406: C7.1 8.88,3.94 Y1.1 9.79,3.95 12.95,7.11 U$4.7
XO
  Top 0.406: C6.1 Y1.2 11.14,8.25 U$4.8

### Text on the board
tNames: VCC5V